# EAGLE design WS2812 hart (EAGLE 7.3.0)
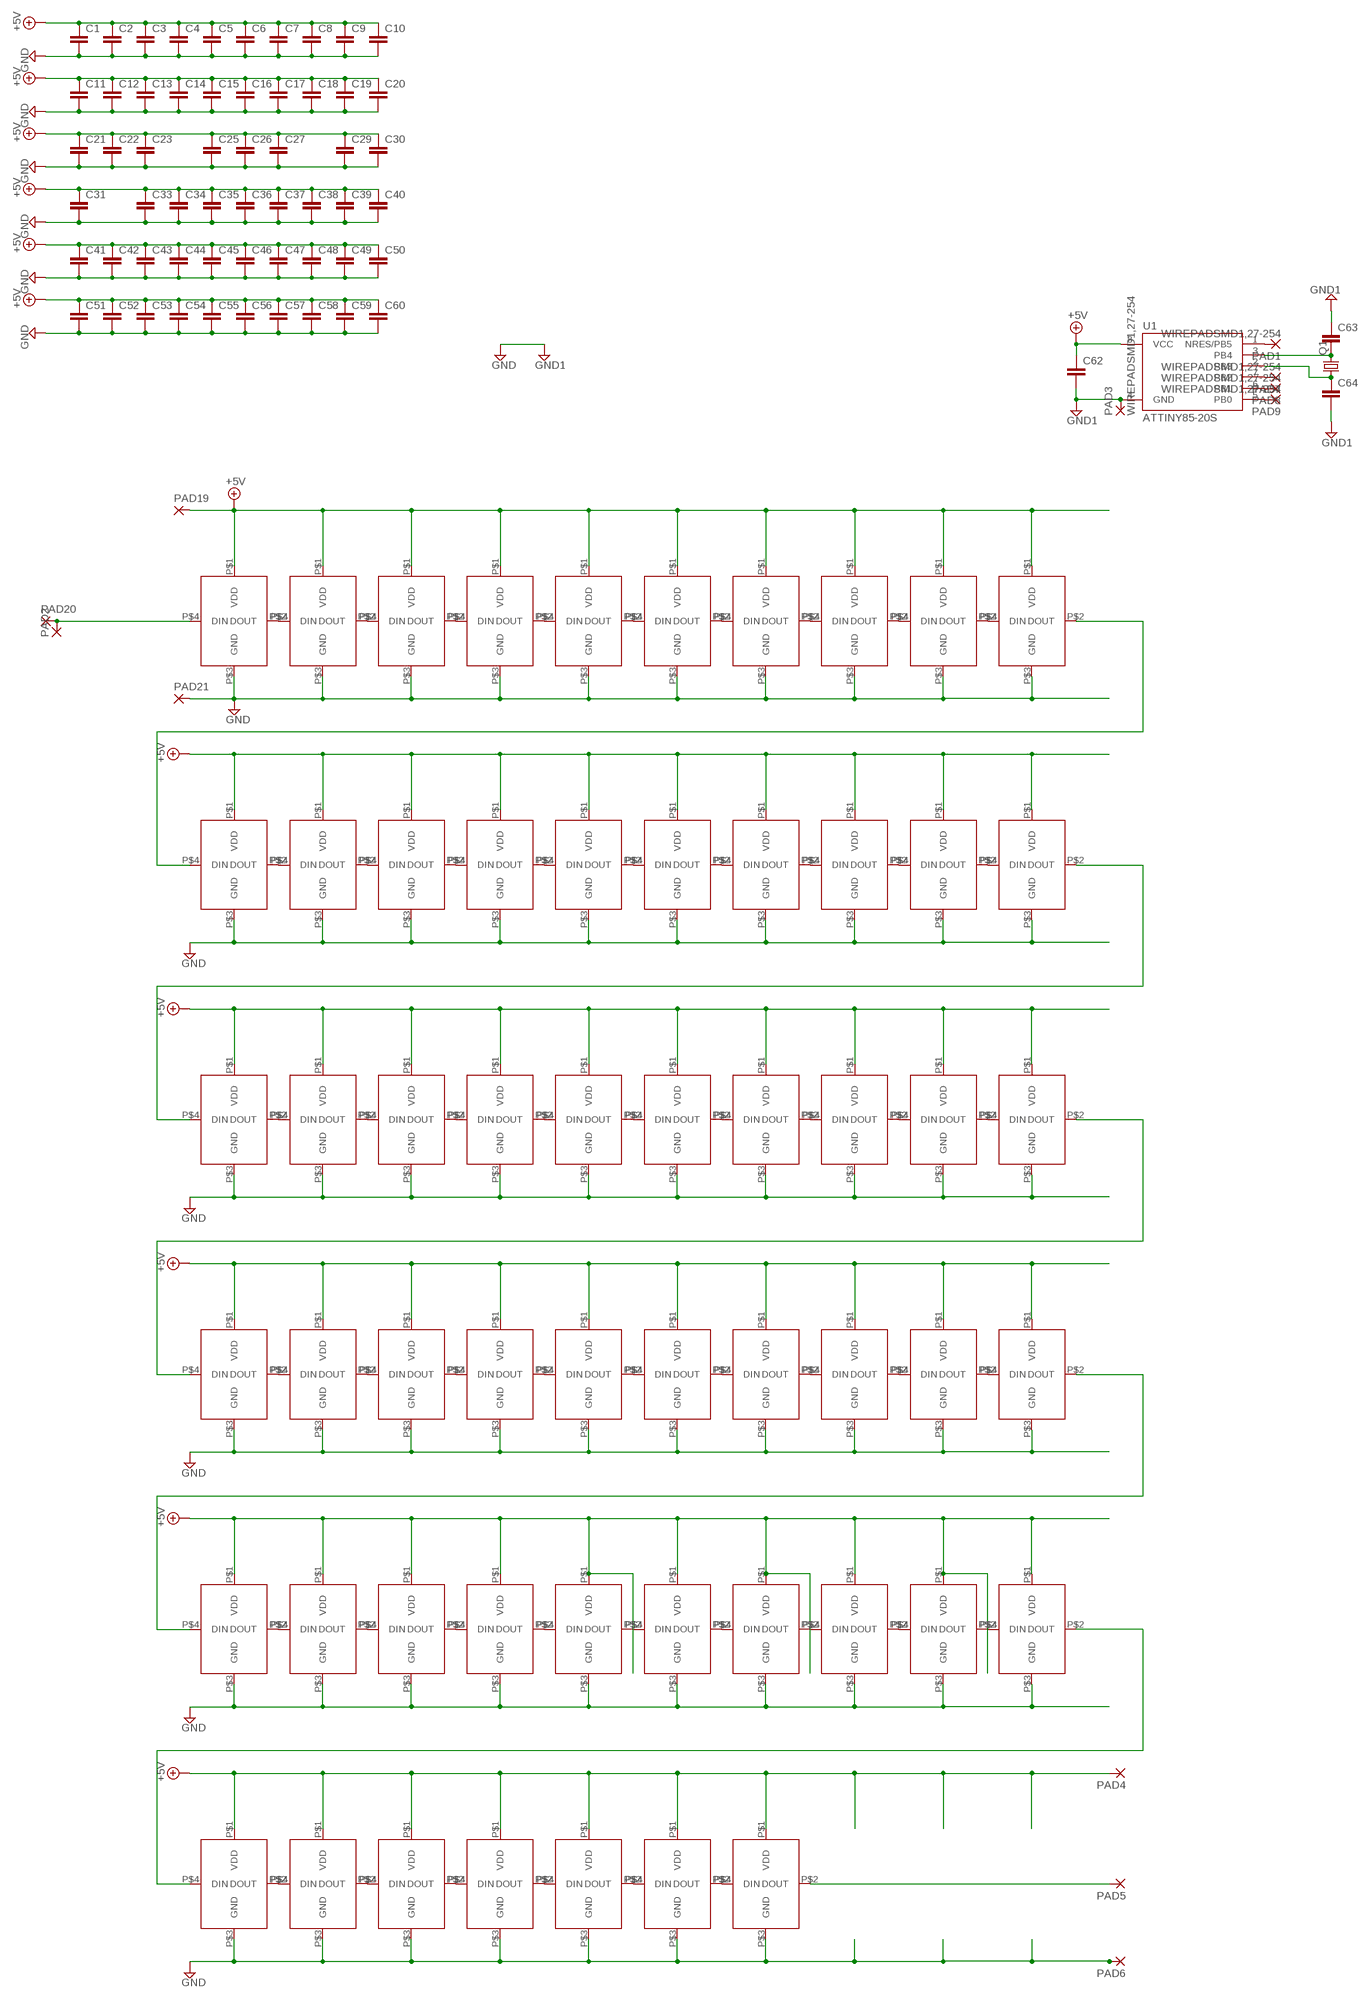
[diagram p0: schematic, sheet 1]

## Parts
C1  C-EUC1206K  [C1206K]
C2  C-EUC1206K  [C1206K]
C3  C-EUC1206K  [C1206K]
C4  C-EUC1206K  [C1206K]
C5  C-EUC1206K  [C1206K]
C6  C-EUC1206K  [C1206K]
C7  C-EUC1206K  [C1206K]
C8  C-EUC1206K  [C1206K]
C9  C-EUC1206K  [C1206K]
C10  C-EUC1206K  [C1206K]
C11  C-EUC1206K  [C1206K]
C12  C-EUC1206K  [C1206K]
C13  C-EUC1206K  [C1206K]
C14  C-EUC1206K  [C1206K]
C15  C-EUC1206K  [C1206K]
C16  C-EUC1206K  [C1206K]
C17  C-EUC0805K  [C0805K]
C18  C-EUC1206K  [C1206K]
C19  C-EUC1206K  [C1206K]
C20  C-EUC1206K  [C1206K]
C21  C-EUC1206K  [C1206K]
C22  C-EUC1206K  [C1206K]
C23  C-EUC1206K  [C1206K]
C25  C-EUC1206K  [C1206K]
C26  C-EUC1206K  [C1206K]
C27  C-EUC1206K  [C1206K]
C29  C-EUC1206K  [C1206K]
C30  C-EUC1206K  [C1206K]
C31  C-EUC1206K  [C1206K]
C33  C-EUC1206K  [C1206K]
C34  C-EUC1206K  [C1206K]
C35  C-EUC1206K  [C1206K]
C36  C-EUC1206K  [C1206K]
C37  C-EUC1206K  [C1206K]
C38  C-EUC1206K  [C1206K]
C39  C-EUC1206K  [C1206K]
C40  C-EUC1206K  [C1206K]
C41  C-EUC1206K  [C1206K]
C42  C-EUC1206K  [C1206K]
C43  C-EUC1206K  [C1206K]
C44  C-EUC1206K  [C1206K]
C45  C-EUC1206K  [C1206K]
C46  C-EUC1206K  [C1206K]
C47  C-EUC1206K  [C1206K]
C48  C-EUC1206K  [C1206K]
C49  C-EUC1206K  [C1206K]
C50  C-EUC1206K  [C1206K]
C51  C-EUC1206K  [C1206K]
C52  C-EUC0805K  [C0805K]
C53  C-EUC1206K  [C1206K]
C54  C-EUC1206K  [C1206K]
C55  C-EUC1206K  [C1206K]
C56  C-EUC1206K  [C1206K]
C57  C-EUC1206K  [C1206K]
C58  C-EUC1206K  [C1206K]
C59  C-EUC1206K  [C1206K]
C60  C-EUC1206K  [C1206K]
C62  C-EUC0805K  [C0805K]
C63  C-EUC0603K  [C0603K]
C64  C-EUC0603K  [C0603K]
PAD1  WIREPADSMD1,27-254  [SMD1,27-2,54]
PAD2  SMD5  [SMD2,54-5,08]
PAD3  WIREPADSMD1,27-254  [SMD1,27-2,54]
PAD4  1,6/0,8  [1,6/0,8]
PAD5  1,6/0,8  [1,6/0,8]
PAD6  1,6/0,8  [1,6/0,8]
PAD7  WIREPADSMD1,27-254  [SMD1,27-2,54]
PAD8  WIREPADSMD1,27-254  [SMD1,27-2,54]
PAD9  WIREPADSMD1,27-254  [SMD1,27-2,54]
PAD19  1,6/0,8  [1,6/0,8]
PAD20  1,6/0,8  [1,6/0,8]
PAD21  1,6/0,8  [1,6/0,8]
Q1  CRYSTALHC49S  [HC49/S]
U1  ATTINY85-20S  [SOIC8_EIAJ_208MIL]
U$1  WS2812B  [PLCC-4]
U$2  WS2812B  [PLCC-4]
U$3  WS2812B  [PLCC-4]
U$4  WS2812B  [PLCC-4]
U$5  WS2812B  [PLCC-4]
U$6  WS2812B  [PLCC-4]
U$7  WS2812B  [PLCC-4]
U$8  WS2812B  [PLCC-4]
U$9  WS2812B  [PLCC-4]
U$10  WS2812B  [PLCC-4]
U$11  WS2812B  [PLCC-4]
U$12  WS2812B  [PLCC-4]
U$13  WS2812B  [PLCC-4]
U$14  WS2812B  [PLCC-4]
U$15  WS2812B  [PLCC-4]
U$16  WS2812B  [PLCC-4]
U$17  WS2812B  [PLCC-4]
U$18  WS2812B  [PLCC-4]
U$19  WS2812B  [PLCC-4]
U$20  WS2812B  [PLCC-4]
U$21  WS2812B  [PLCC-4]
U$22  WS2812B  [PLCC-4]
U$23  WS2812B  [PLCC-4]
U$24  WS2812B  [PLCC-4]
U$25  WS2812B  [PLCC-4]
U$26  WS2812B  [PLCC-4]
U$27  WS2812B  [PLCC-4]
U$28  WS2812B  [PLCC-4]
U$29  WS2812B  [PLCC-4]
U$30  WS2812B  [PLCC-4]
U$31  WS2812B  [PLCC-4]
U$32  WS2812B  [PLCC-4]
U$33  WS2812B  [PLCC-4]
U$34  WS2812B  [PLCC-4]
U$35  WS2812B  [PLCC-4]
U$36  WS2812B  [PLCC-4]
U$37  WS2812B  [PLCC-4]
U$38  WS2812B  [PLCC-4]
U$39  WS2812B  [PLCC-4]
U$40  WS2812B  [PLCC-4]
U$41  WS2812B  [PLCC-4]
U$42  WS2812B  [PLCC-4]
U$43  WS2812B  [PLCC-4]
U$44  WS2812B  [PLCC-4]
U$45  WS2812B  [PLCC-4]
U$46  WS2812B  [PLCC-4]
U$47  WS2812B  [PLCC-4]
U$48  WS2812B  [PLCC-4]
U$49  WS2812B  [PLCC-4]
U$50  WS2812B  [PLCC-4]
U$51  WS2812B  [PLCC-4]
U$52  WS2812B  [PLCC-4]
U$53  WS2812B  [PLCC-4]
U$54  WS2812B  [PLCC-4]
U$55  WS2812B  [PLCC-4]
U$56  WS2812B  [PLCC-4]
U$57  WS2812B  [PLCC-4]

## Nets
+5V: C1.1 C2.1 C3.1 C4.1 C5.1 C6.1 C7.1 C8.1 C9.1 C10.1 C11.1 C12.1 C13.1 C14.1 C15.1 C16.1 C17.1 C18.1 C19.1 C20.1 C21.1 C22.1 C23.1 C25.1 C26.1 C27.1 C29.1 C30.1 C31.1 C33.1 C34.1 C35.1 C36.1 C37.1 C38.1 C39.1 C40.1 C41.1 C42.1 C43.1 C44.1 C45.1 C46.1 C47.1 C48.1 C49.1 C50.1 C51.1 C52.1 C53.1 C54.1 C55.1 C56.1 C57.1 C58.1 C59.1 C60.1 C62.1 PAD4.1(P) PAD19.1(P) U1.8(VCC) U$1.P$1(VDD) U$2.P$1(VDD) U$3.P$1(VDD) U$4.P$1(VDD) U$5.P$1(VDD) U$6.P$1(VDD) U$7.P$1(VDD) U$8.P$1(VDD) U$9.P$1(VDD) U$10.P$1(VDD) U$11.P$1(VDD) U$12.P$1(VDD) U$13.P$1(VDD) U$14.P$1(VDD) U$15.P$1(VDD) U$16.P$1(VDD) U$17.P$1(VDD) U$18.P$1(VDD) U$19.P$1(VDD) U$20.P$1(VDD) U$21.P$1(VDD) U$22.P$1(VDD) U$23.P$1(VDD) U$24.P$1(VDD) U$25.P$1(VDD) U$26.P$1(VDD) U$27.P$1(VDD) U$28.P$1(VDD) U$29.P$1(VDD) U$30.P$1(VDD) U$31.P$1(VDD) U$32.P$1(VDD) U$33.P$1(VDD) U$34.P$1(VDD) U$35.P$1(VDD) U$36.P$1(VDD) U$37.P$1(VDD) U$38.P$1(VDD) U$39.P$1(VDD) U$40.P$1(VDD) U$41.P$1(VDD) U$42.P$1(VDD) U$43.P$1(VDD) U$44.P$1(VDD) U$45.P$1(VDD) U$46.P$1(VDD) U$47.P$1(VDD) U$48.P$1(VDD) U$49.P$1(VDD) U$50.P$1(VDD) U$51.P$1(VDD) U$52.P$1(VDD) U$53.P$1(VDD) U$54.P$1(VDD) U$55.P$1(VDD) U$56.P$1(VDD) U$57.P$1(VDD)
GND: C1.2 C2.2 C3.2 C4.2 C5.2 C6.2 C7.2 C8.2 C9.2 C10.2 C11.2 C12.2 C13.2 C14.2 C15.2 C16.2 C17.2 C18.2 C19.2 C20.2 C21.2 C22.2 C23.2 C25.2 C26.2 C27.2 C29.2 C30.2 C31.2 C33.2 C34.2 C35.2 C36.2 C37.2 C38.2 C39.2 C40.2 C41.2 C42.2 C43.2 C44.2 C45.2 C46.2 C47.2 C48.2 C49.2 C50.2 C51.2 C52.2 C53.2 C54.2 C55.2 C56.2 C57.2 C58.2 C59.2 C60.2 C62.2 C63.1 C64.2 PAD3.1(P) PAD6.1(P) PAD21.1(P) U1.4(GND) U$1.P$3(GND) U$2.P$3(GND) U$3.P$3(GND) U$4.P$3(GND) U$5.P$3(GND) U$6.P$3(GND) U$7.P$3(GND) U$8.P$3(GND) U$9.P$3(GND) U$10.P$3(GND) U$11.P$3(GND) U$12.P$3(GND) U$13.P$3(GND) U$14.P$3(GND) U$15.P$3(GND) U$16.P$3(GND) U$17.P$3(GND) U$18.P$3(GND) U$19.P$3(GND) U$20.P$3(GND) U$21.P$3(GND) U$22.P$3(GND) U$23.P$3(GND) U$24.P$3(GND) U$25.P$3(GND) U$26.P$3(GND) U$27.P$3(GND) U$28.P$3(GND) U$29.P$3(GND) U$30.P$3(GND) U$31.P$3(GND) U$32.P$3(GND) U$33.P$3(GND) U$34.P$3(GND) U$35.P$3(GND) U$36.P$3(GND) U$37.P$3(GND) U$38.P$3(GND) U$39.P$3(GND) U$40.P$3(GND) U$41.P$3(GND) U$42.P$3(GND) U$43.P$3(GND) U$44.P$3(GND) U$45.P$3(GND) U$46.P$3(GND) U$47.P$3(GND) U$48.P$3(GND) U$49.P$3(GND) U$50.P$3(GND) U$51.P$3(GND) U$52.P$3(GND) U$53.P$3(GND) U$54.P$3(GND) U$55.P$3(GND) U$56.P$3(GND) U$57.P$3(GND) ; supply symbol labelled GND1
N$1: U$41.P$2(DOUT) U$42.P$4(DIN)
N$2: U$2.P$2(DOUT) U$3.P$4(DIN)
N$3: U$3.P$2(DOUT) U$4.P$4(DIN)
N$4: U$4.P$2(DOUT) U$5.P$4(DIN)
N$5: U$5.P$2(DOUT) U$6.P$4(DIN)
N$6: U$6.P$2(DOUT) U$7.P$4(DIN)
N$7: U$7.P$2(DOUT) U$8.P$4(DIN)
N$8: U$8.P$2(DOUT) U$9.P$4(DIN)
N$9: U$9.P$2(DOUT) U$10.P$4(DIN)
N$10: U$11.P$2(DOUT) U$12.P$4(DIN)
N$11: U$1.P$4(DIN) U$10.P$2(DOUT)
N$12: U$1.P$2(DOUT) U$41.P$4(DIN)
N$13: U$12.P$2(DOUT) U$13.P$4(DIN)
N$14: U$13.P$2(DOUT) U$14.P$4(DIN)
N$15: U$14.P$2(DOUT) U$15.P$4(DIN)
N$16: U$15.P$2(DOUT) U$16.P$4(DIN)
N$17: U$16.P$2(DOUT) U$17.P$4(DIN)
N$18: U$17.P$2(DOUT) U$18.P$4(DIN)
N$19: U$18.P$2(DOUT) U$19.P$4(DIN)
N$20: U$42.P$2(DOUT) U$43.P$4(DIN)
N$21: U$19.P$2(DOUT) U$20.P$4(DIN)
N$22: U$2.P$4(DIN) U$20.P$2(DOUT)
N$23: U$21.P$2(DOUT) U$22.P$4(DIN)
N$24: U$22.P$2(DOUT) U$23.P$4(DIN)
N$25: U$23.P$2(DOUT) U$24.P$4(DIN)
N$26: U$24.P$2(DOUT) U$25.P$4(DIN)
N$27: U$25.P$2(DOUT) U$26.P$4(DIN)
N$28: U$26.P$2(DOUT) U$27.P$4(DIN)
N$29: U$27.P$2(DOUT) U$28.P$4(DIN)
N$30: U$28.P$2(DOUT) U$29.P$4(DIN)
N$31: U$21.P$4(DIN) U$40.P$2(DOUT)
N$32: U$29.P$2(DOUT) U$30.P$4(DIN)
N$33: U$11.P$4(DIN) U$30.P$2(DOUT)
N$34: U$31.P$2(DOUT) U$32.P$4(DIN)
N$35: U$32.P$2(DOUT) U$33.P$4(DIN)
N$36: U$33.P$2(DOUT) U$34.P$4(DIN)
N$37: U$34.P$2(DOUT) U$35.P$4(DIN)
N$38: U$35.P$2(DOUT) U$36.P$4(DIN)
N$39: U$36.P$2(DOUT) U$37.P$4(DIN)
N$40: U$37.P$2(DOUT) U$38.P$4(DIN)
N$41: U$38.P$2(DOUT) U$39.P$4(DIN)
N$42: PAD2.1(P) PAD20.1(P) U$31.P$4(DIN)
N$43: U$39.P$2(DOUT) U$40.P$4(DIN)
N$44: U$43.P$2(DOUT) U$44.P$4(DIN)
N$45: U$44.P$2(DOUT) U$45.P$4(DIN)
N$46: U$45.P$2(DOUT) U$46.P$4(DIN)
N$47: U$46.P$2(DOUT) U$47.P$4(DIN)
N$48: U$47.P$2(DOUT) U$48.P$4(DIN)
N$49: U$48.P$2(DOUT) U$49.P$4(DIN)
N$50: U$49.P$2(DOUT) U$50.P$4(DIN)
N$51: U$50.P$2(DOUT) U$51.P$4(DIN)
N$52: C63.2 Q1.2 U1.3(PB4)
N$53: U$51.P$2(DOUT) U$52.P$4(DIN)
N$54: U$52.P$2(DOUT) U$53.P$4(DIN)
N$55: U$53.P$2(DOUT) U$54.P$4(DIN)
N$56: U$54.P$2(DOUT) U$55.P$4(DIN)
N$57: U$55.P$2(DOUT) U$56.P$4(DIN)
N$58: U$56.P$2(DOUT) U$57.P$4(DIN)
N$59: C64.1 Q1.1 U1.2(PB3)
N$60: PAD1.1(P) U1.1(NRES/PB5)
N$62: PAD5.1(P) U$57.P$2(DOUT)
N$64: PAD7.1(P) U1.7(PB2)
N$65: PAD8.1(P) U1.6(PB1)
N$66: PAD9.1(P) U1.5(PB0)

## Library data of the parts
C1-C23 C25-C27 C29-C31 C33-C60 C62-C64 = rcl:C-EU: CAPACITOR, European symbol
PAD1 PAD3 PAD7-PAD9 = wirepad:WIREPAD: Wire PAD connect wire on PCB
PAD2 = wirepad:SMD5: SMD PAD
PAD4-PAD6 PAD19-PAD21 = wirepad:1,6/0,8: THROUGH-HOLE PAD
Q1 = crystal:CRYSTAL: CRYSTAL; OC_FARNELL: 1667008; OC_NEWARK: unknown
U1 = attiny25_45_85:ATTINY85*: ATMEL ATtiny 85 Packages: P = PDIP 08 30mil S = SOIC 08 EIAJ 208mil Technologies Note: for complete ordering code (temp. range, finish, tape&reel etc.) see www.atmel.com • Supply Voltage: V = (1.8…5.5)V | [blank] = (2.7…5.5)V • Speed: 10 = 10 MHz | 20 = 20 MHz Author: Dipl.-Ing. FH Rainer Bayer HHN Hochschule Heilbronn (Heilbronn University), rainer.bayer@hs-heilbronn.de Ingenieurbüro ing-rb, mail@ing-rb.de
U$1-U$57 = Roy:WS2812B

## Board
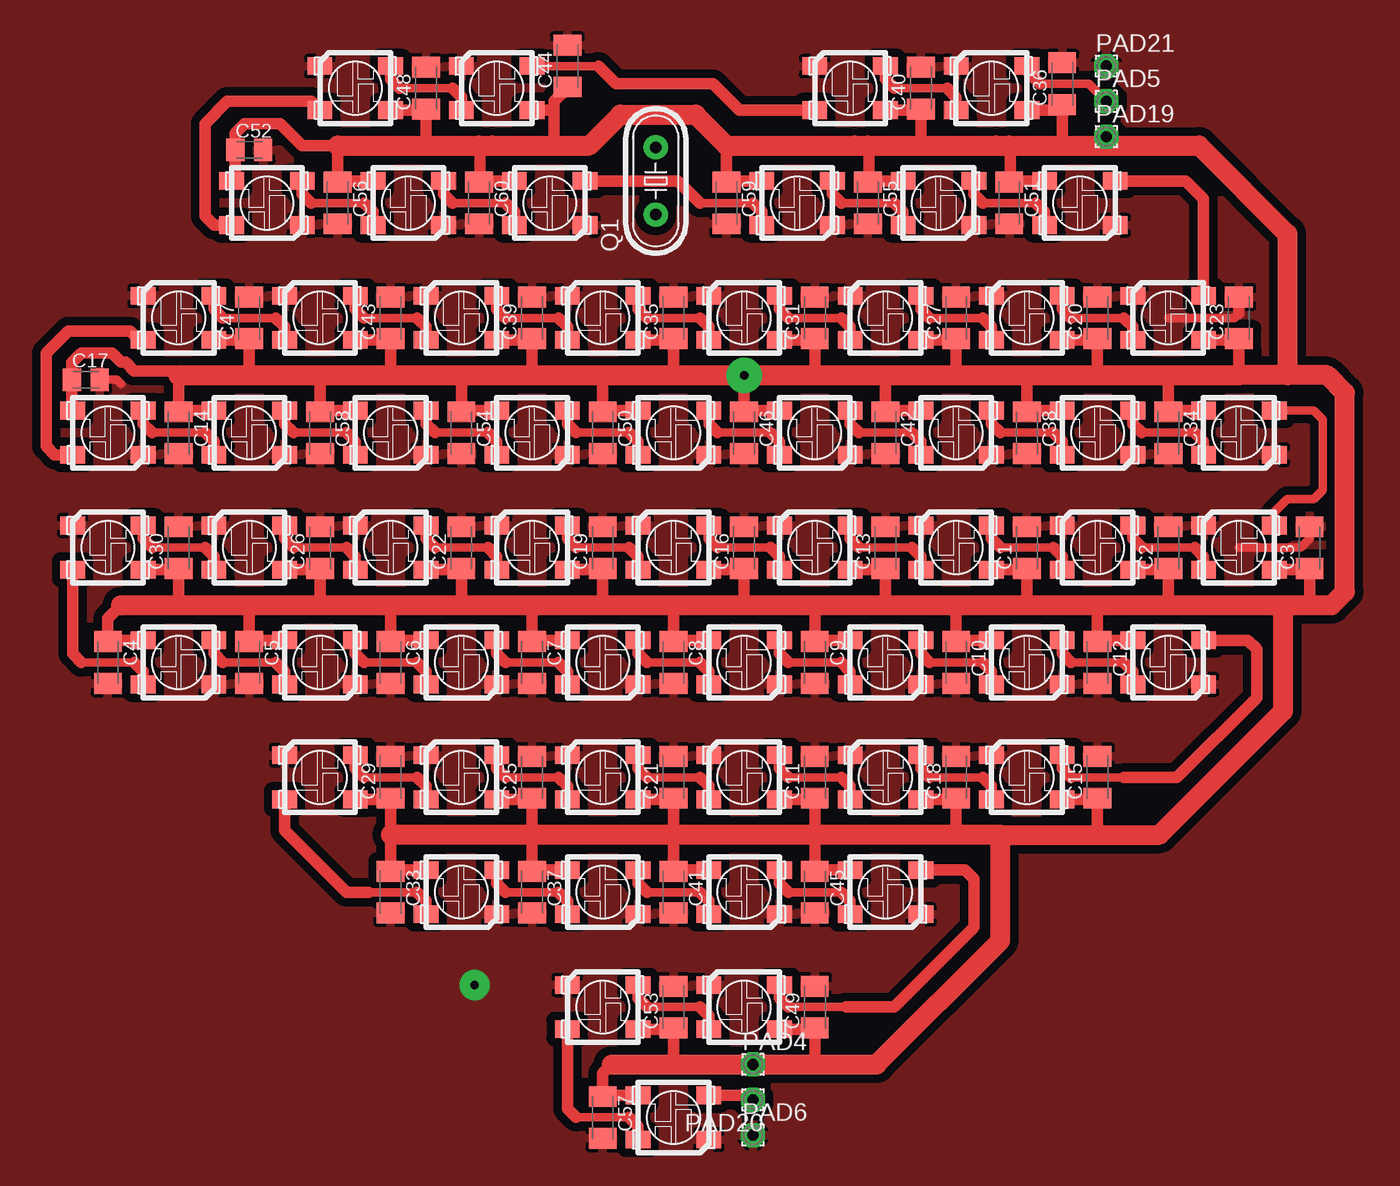
[diagram p1: board, top side]
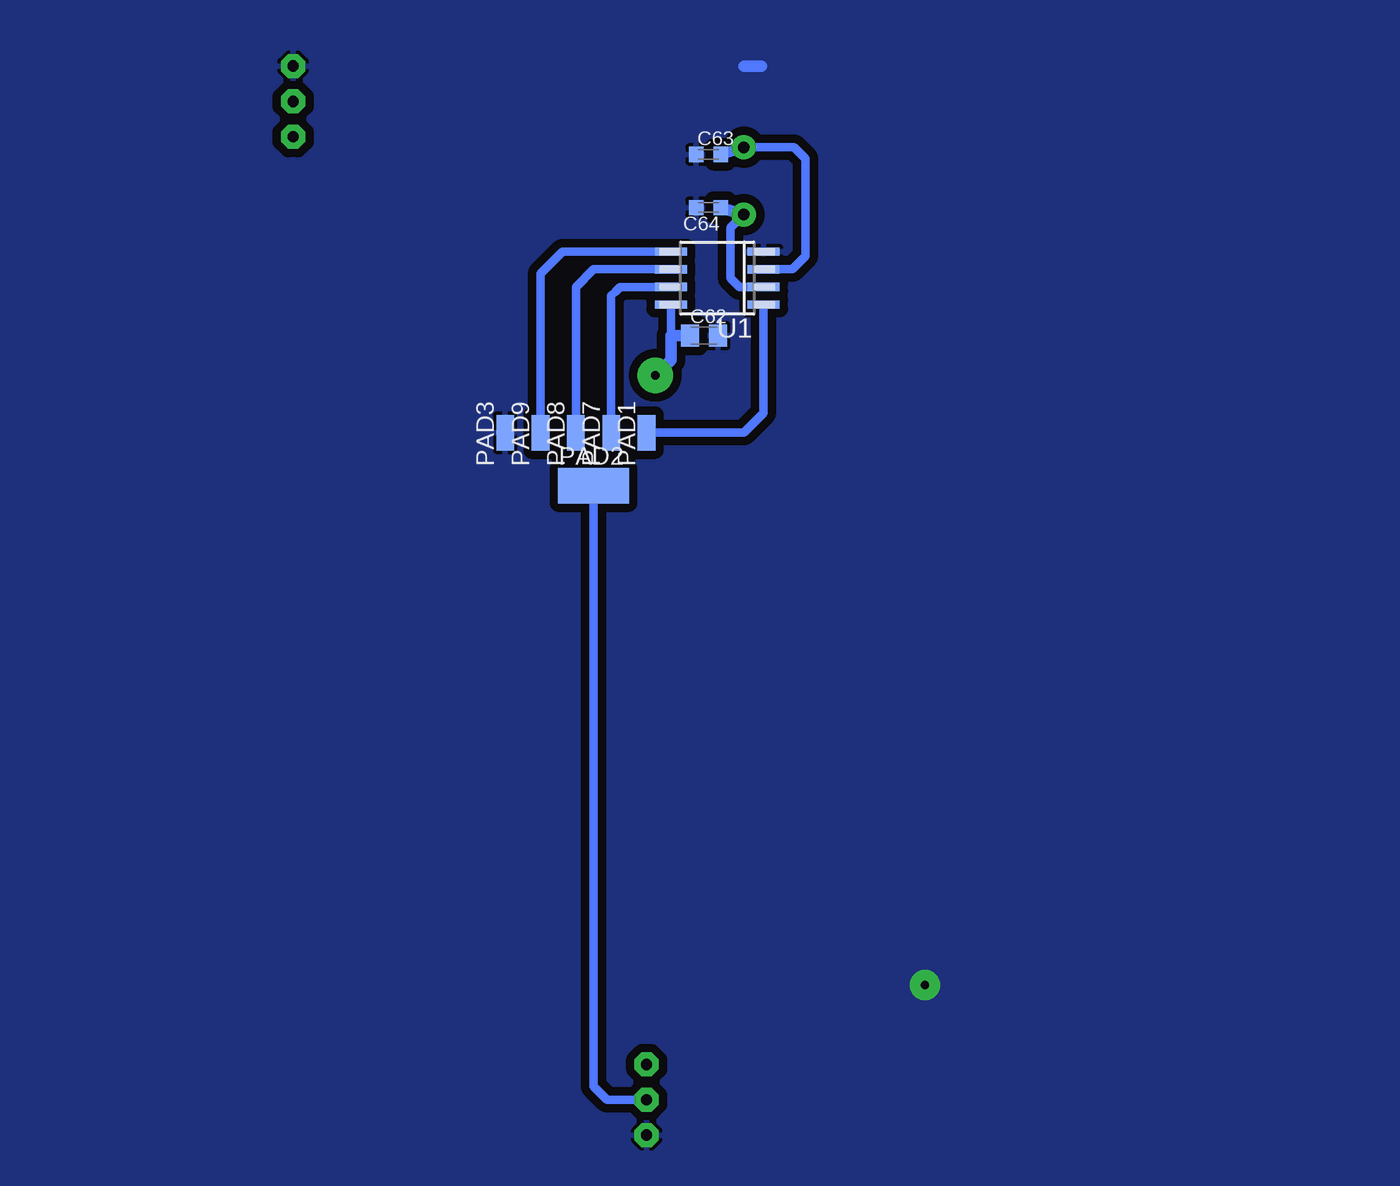
[diagram p2: board, bottom side, seen from below]

No outline drawn. Coordinates in mm, seen from the top.
Copper layers (1*16): Top 0.035mm / dielectric 1.5mm / Bottom 0.035mm
Design rules "default *": minimum track width 10mil, minimum drill 19mil, track to track 8mil, track to pad 8mil, pad to pad 8mil, via to via 8mil, smd to smd 8mil, copper to edge 40mil, drill to drill 8mil, minimum pad ring 18mil, minimum via ring 8mil, stop-mask expansion 4mil, vias tented up to drill 0mil, thermal gap 10mil
tRestrict: 1 lines

### Footprints (pad centres in the part's own frame; a part is rotated, then mirrored left to right if it is on the bottom)
C1206K = smd 1.5 x 2: 1 -1.5,0; 2 1.5,0
C0805K = smd 1.3 x 1.6: 1 -1,0; 2 1,0
C0603K = smd 1.05 x 1.08: 1 -0.875,0; 2 0.875,0
SMD1,27-2,54 = smd 1.27 x 2.54: 1 0,0
SMD2,54-5,08 = smd 2.54 x 5.08: 1 0,0
1,6/0,8 = drill 0.813 pad 1.6 octagon: 1 0,0
HC49/S = drill 0.813: 1 -2.413,0; 2 2.413,0
SOIC8_EIAJ_208MIL = smd 0.6 x 2.286: 1 -1.905,-3.33; 2 -0.635,-3.33; 3 0.635,-3.33; 4 1.905,-3.33; 5 1.905,3.33; 6 0.635,3.33; 7 -0.635,3.33; 8 -1.905,3.33
PLCC-4 = smd 1.778 x 1.27: P$1 -2.54,1.587; P$2 -2.54,-1.587; P$3 2.54,-1.587; P$4 2.54,1.587

### Placement (x,y rotation side)
C1  74.3,42.55 90 top
C2  84.45,42.55 90 top
C3  94.61,42.55 90 top
C4  8.26,34.29 270 top
C5  18.41,34.29 270 top
C6  28.57,34.29 270 top
C7  38.73,34.29 270 top
C8  48.9,34.29 270 top
C9  59.05,34.29 270 top
C10  69.22,34.29 270 top
C11  59.05,26.04 90 top
C12  79.38,34.29 270 top
C13  64.14,42.55 90 top
C14  13.34,50.8 270 top
C15  79.38,26.04 90 top
C16  53.98,42.55 90 top
C17  6.67,54.61 0 top
C18  69.22,26.04 90 top
C19  43.81,42.55 90 top
C20  79.38,59.05 90 top
C21  48.9,26.04 90 top
C22  33.66,42.55 90 top
C23  89.53,59.05 90 top
C25  38.73,26.04 90 top
C26  23.5,42.55 90 top
C27  69.22,59.05 90 top
C29  28.57,26.04 90 top
C30  13.34,42.55 90 top
C31  59.05,59.05 90 top
C33  28.57,17.78 270 top
C34  84.45,50.8 270 top
C35  48.9,59.05 90 top
C36  76.83,75.88 90 top
C37  38.73,17.78 270 top
C38  74.3,50.8 270 top
C39  38.73,59.05 90 top
C40  66.67,75.56 90 top
C41  48.9,17.78 270 top
C42  64.14,50.8 270 top
C43  28.57,59.05 90 top
C44  41.27,77.15 90 top
C45  59.05,17.78 270 top
C46  53.98,50.8 270 top
C47  18.41,59.05 90 top
C48  31.11,75.56 90 top
C49  59.05,9.53 90 top
C50  43.81,50.8 270 top
C51  73.03,67.31 270 top
C52  18.41,71.12 0 top
C53  48.9,9.53 90 top
C54  33.66,50.8 270 top
C55  62.87,67.31 270 top
C56  24.77,67.31 270 top
C57  43.81,1.59 270 top
C58  23.5,50.8 270 top
C59  52.7,67.31 270 top
C60  34.92,67.31 270 top
C62  50.48,57.78 0 bottom
C63  50.16,70.8 0 bottom
C64  50.16,66.99 180 bottom
PAD1  54.61,50.8 0 bottom
PAD2  58.42,46.99 270 bottom
PAD3  64.77,50.8 0 bottom
PAD4  54.61,5.4 0 top
PAD5  80.01,74.61 0 top
PAD6  54.61,0.32 0 top
PAD7  57.15,50.8 0 bottom
PAD8  59.69,50.8 0 bottom
PAD9  62.23,50.8 0 bottom
PAD19  80.01,72.07 0 top
PAD20  54.61,2.86 180 top
PAD21  80.01,77.15 0 top
Q1  47.62,68.9 90 top
U1  49.53,61.91 90 bottom
U$1  13.34,59.05 180 top
U$2  89.53,50.8 0 top
U$3  79.38,50.8 0 top
U$4  69.22,50.8 0 top
U$5  59.05,50.8 0 top
U$6  48.9,50.8 0 top
U$7  38.73,50.8 0 top
U$8  28.57,50.8 0 top
U$9  18.41,50.8 0 top
U$10  8.26,50.8 0 top
U$11  13.34,34.29 0 top
U$12  8.26,42.55 180 top
U$13  18.41,42.55 180 top
U$14  28.57,42.55 180 top
U$15  38.73,42.55 180 top
U$16  48.9,42.55 180 top
U$17  59.05,42.55 180 top
U$18  69.22,42.55 180 top
U$19  79.38,42.55 180 top
U$20  89.53,42.55 180 top
U$21  53.98,26.04 180 top
U$22  64.14,26.04 180 top
U$23  74.3,26.04 180 top
U$24  84.45,34.29 0 top
U$25  74.3,34.29 0 top
U$26  64.14,34.29 0 top
U$27  53.98,34.29 0 top
U$28  43.81,34.29 0 top
U$29  33.66,34.29 0 top
U$30  23.5,34.29 0 top
U$31  48.9,1.59 0 top
U$32  43.81,9.53 180 top
U$33  53.98,9.53 180 top
U$34  64.14,17.78 0 top
U$35  53.98,17.78 0 top
U$36  43.81,17.78 0 top
U$37  33.66,17.78 0 top
U$38  23.5,26.04 180 top
U$39  33.66,26.04 180 top
U$40  43.81,26.04 180 top
U$41  23.5,59.05 180 top
U$42  33.66,59.05 180 top
U$43  43.81,59.05 180 top
U$44  53.98,59.05 180 top
U$45  64.14,59.05 180 top
U$46  74.3,59.05 180 top
U$47  84.45,59.05 180 top
U$48  78.11,67.31 0 top
U$49  67.94,67.31 0 top
U$50  57.78,67.31 0 top
U$51  40.01,67.31 0 top
U$52  29.84,67.31 0 top
U$53  19.68,67.31 0 top
U$54  26.04,75.56 180 top
U$55  36.2,75.56 180 top
U$56  61.59,75.56 180 top
U$57  71.75,75.56 180 top

### Tracks (layer width: path | path; a pad name or v marks a point on that pad's centre or on a via)
+5V  (via drill 0.6 pad 2.54)
  Top 0.813: 61.59,19.05 U$34.P$1 59.14,19.37 C45.1 59.05,21.91 C11.1 58.97,24.45 U$21.P$1 | 76.83,57.78 U$46.P$1 79.29,57.47 C20.1 79.38,54.93 | 37.78,68.9 U$51.P$1 35.01,68.9 | PAD19.1 80.01,71.44 | 36.11,71.67 35.88,71.44 | 25.95,71.53 24.77,71.44 | 61.51,71.53 61.91,71.44 | 71.67,71.53 72.07,71.44 | 66.67,71.44 C40.1 66.59,73.98 U$56.P$1 | 76.83,71.44 C36.1 76.43,73.98 U$57.P$1 | C44.1 41.27,75.56 40.32,74.61 40.32,73.98 | 40.32,73.98 40.32,71.44 | U$55.P$1 40.32,73.98 | 31.11,71.44 C48.1 31.03,73.98 U$54.P$1 | U$52.P$1 24.85,68.9 | 24.85,68.9 C56.1 | 35.01,68.9 C60.1 | U$49.P$1 62.95,68.9 | 62.95,68.9 C55.1 | U$48.P$1 73.11,68.9 | 73.11,68.9 C51.1 | 35.01,68.9 35.01,71.35 34.92,71.44 | 62.95,68.9 62.95,71.35 62.87,71.44 | 73.11,68.9 73.11,71.35 73.03,71.44 | 89.53,54.93 C23.1 89.45,57.47 U$47.P$1 | 69.22,54.93 C27.1 69.13,57.47 U$45.P$1 | 58.74,54.93 59.05,55.24 C31.1 58.97,57.47 U$44.P$1 | U$50.P$1 52.79,68.9 C59.1 52.7,71.44 | 23.5,54.93 C58.1 23.58,52.39 U$8.P$1 | 33.66,54.93 C54.1 33.74,52.39 U$7.P$1 | 43.81,54.93 C50.1 43.9,52.39 U$6.P$1 | v53.98,54.93 C46.1 54.06,52.39 U$5.P$1 | 64.14,54.93 C42.1 64.22,52.39 U$4.P$1 | 74.61,54.93 74.3,54.61 C38.1 74.38,52.39 U$3.P$1 | 84.45,54.93 C34.1 84.54,52.39 U$2.P$1 | U$9.P$1 13.42,52.39 C14.1 13.34,54.93 13.02,55.24 10.16,55.24 9.53,55.88 9.21,55.88 8.57,56.52 6.35,56.52 5.67,55.83 C17.1 5.67,52.75 U$10.P$1 | 18.41,54.93 C47.1 18.33,57.47 U$1.P$1 | 28.57,54.93 C43.1 28.49,57.47 U$41.P$1 | 38.73,54.93 C39.1 38.65,57.47 U$42.P$1 | 48.58,54.93 48.9,55.24 C35.1 48.81,57.47 U$43.P$1 | 13.34,38.42 C30.1 13.25,40.96 U$12.P$1 | 23.5,38.42 C26.1 23.41,40.96 U$13.P$1 | 33.66,38.42 C22.1 33.57,40.96 U$14.P$1
  Top 0.813: 43.81,38.42 C19.1 43.73,40.96 U$15.P$1 | 53.98,38.42 C16.1 53.89,40.96 U$16.P$1 | 64.14,38.42 C13.1 64.05,40.96 U$17.P$1 | 74.3,38.42 C1.1 74.21,40.96 U$18.P$1 | 84.45,38.42 C2.1 84.37,40.96 U$19.P$1 | 94.61,38.42 C3.1 94.53,40.96 U$20.P$1 | 9.21,38.42 8.26,37.47 C4.1 8.34,35.88 U$11.P$1 | 18.41,38.42 C5.1 18.5,35.88 U$30.P$1 | 28.57,38.42 C6.1 28.66,35.88 U$29.P$1 | 38.73,38.42 C7.1 38.82,35.88 U$28.P$1 | 48.9,38.42 C8.1 48.98,35.88 U$27.P$1 | 59.05,38.42 C9.1 59.14,35.88 U$26.P$1 | 69.22,38.42 C10.1 69.3,35.88 U$25.P$1 | 79.38,38.42 C12.1 79.46,35.88 U$24.P$1 | 69.22,21.91 C18.1 69.13,24.45 U$22.P$1 | 79.38,21.91 C15.1 79.29,24.45 U$23.P$1 | U$40.P$1 48.81,24.45 C21.1 48.9,21.91 C41.1 48.98,19.37 U$35.P$1 | U$39.P$1 38.65,24.45 C25.1 38.73,21.91 C37.1 38.82,19.37 U$36.P$1 | U$38.P$1 28.49,24.45 C29.1 28.57,21.91 C33.1 28.66,19.37 U$37.P$1 | 59.05,5.4 C49.1 58.97,7.94 U$33.P$1 | 48.9,5.4 C53.1 48.81,7.94 U$32.P$1 | 44.45,5.4 43.81,4.76 C57.1 43.9,3.17 U$31.P$1 | U$53.P$1 17.41,69.17 C52.1 17.41,72.34 18.1,73.03 20.64,73.03 22.23,71.44 24.77,71.44 | 24.85,68.9 24.77,68.98 24.77,71.44
  Top 1.422: 72.39,21.91 69.22,21.91 59.05,21.91 48.9,21.91 38.73,21.91 28.57,21.91 | 44.45,5.4 48.9,5.4 PAD4.1 59.05,5.4 63.5,5.4 72.39,14.29 72.39,21.91 | 9.21,38.42 13.34,38.42 18.41,38.42 23.5,38.42 28.57,38.42 33.66,38.42 38.73,38.42 43.81,38.42 48.9,38.42 53.98,38.42 59.05,38.42 64.14,38.42 69.22,38.42 74.3,38.42 79.38,38.42 84.45,38.42 92.71,38.42 | 13.34,54.93 18.41,54.93 23.5,54.93 28.57,54.93 33.66,54.93 38.73,54.93 43.81,54.93 48.58,54.93 v53.98,54.93 58.74,54.93 64.14,54.93 69.22,54.93 74.61,54.93 79.38,54.93 84.45,54.93 89.53,54.93 93.03,54.93 | 24.77,71.44 31.11,71.44 34.92,71.44 35.88,71.44 40.32,71.44 42.86,71.44 45.09,73.66 50.48,73.66 52.7,71.44 61.91,71.44 62.87,71.44 66.67,71.44 72.07,71.44 73.03,71.44 76.83,71.44 80.01,71.44 86.68,71.44 93.03,65.09 93.03,54.93 | 72.39,21.91 79.38,21.91 83.82,21.91 92.71,30.8 92.71,38.42 | 92.71,38.42 94.61,38.42 96.2,38.42 97.16,39.37 97.16,53.66 95.89,54.93 93.03,54.93
  Bottom 0.61: U1.8 52.86,57.78
  Bottom 0.813: v53.98,54.93 52.86,56.03 52.86,57.78 C62.1
GND  (via drill 0.6 pad 2.18)
  Top 0.61: 7.62,54.61 8.89,54.61 9.21,54.29 | C3.2 94.61,43.18 93.98,42.55 89.53,42.55 | 89.53,59.37 89.22,59.05 84.45,59.05
  Top 0.813: C23.2 89.53,59.37
  Bottom 0.813: 46.35,77.15 47.62,77.15
  other vias: 34.61,11.11
  pour Top (isolate 0.61): -5.08,86.36 102.87,86.36 102.87,-6.35 -5.08,-6.35
  pour Bottom (isolate 0.61): -5.08,86.36 102.87,86.36 102.87,-6.35 -5.08,-6.35
N$1
  Top 0.61: 26.67,59.05 30.48,59.05
  Top 0.813: U$41.P$2 26.04,59.69 26.67,59.05 | 30.48,59.05 31.11,58.42 U$42.P$4
N$2
  Top 0.61: 82.55,50.8 86.36,50.8
  Top 0.813: U$3.P$4 81.92,51.44 82.55,50.8 | 86.36,50.8 87,50.16 U$2.P$2
N$3
  Top 0.61: 72.39,50.8 76.2,50.8
  Top 0.813: U$4.P$4 71.75,51.44 72.39,50.8 | 76.2,50.8 76.83,50.16 U$3.P$2
N$4
  Top 0.61: 62.23,50.8 66.04,50.8
  Top 0.813: U$5.P$4 61.59,51.44 62.23,50.8 | 66.04,50.8 66.67,50.16 U$4.P$2
N$5
  Top 0.61: 52.07,50.8 55.88,50.8
  Top 0.813: U$6.P$4 51.44,51.44 52.07,50.8 | 55.88,50.8 56.52,50.16 U$5.P$2
N$6
  Top 0.61: 41.91,50.8 45.72,50.8
  Top 0.813: U$7.P$4 41.27,51.44 41.91,50.8 | 45.72,50.8 46.35,50.16 U$6.P$2
N$7
  Top 0.61: 31.75,50.8 35.56,50.8
  Top 0.813: U$8.P$4 31.11,51.44 31.75,50.8 | 35.56,50.8 36.2,50.16 U$7.P$2
N$8
  Top 0.61: 21.59,50.8 25.4,50.8
  Top 0.813: U$9.P$4 20.95,51.44 21.59,50.8 | 25.4,50.8 26.04,50.16 U$8.P$2
N$9
  Top 0.61: 11.43,50.8 15.24,50.8
  Top 0.813: U$10.P$4 10.79,51.44 11.43,50.8 | 15.24,50.8 15.88,50.16 U$9.P$2
N$10
  Top 0.61: 10.16,34.29 6.35,34.29
  Top 0.813: U$11.P$2 10.79,33.66 10.16,34.29 | 6.35,34.29 5.71,34.92 U$12.P$4
N$11
  Top 0.813: U$1.P$4 10.48,57.47 9.84,58.1 5.4,58.1 3.81,56.52 3.81,49.85 4.45,49.21 U$10.P$2
N$12
  Top 0.61: 16.51,59.05 20.32,59.05
  Top 0.813: U$1.P$2 15.88,59.69 16.51,59.05 | 20.32,59.05 20.95,58.42 U$41.P$4
N$13
  Top 0.61: 11.43,42.55 15.24,42.55
  Top 0.813: U$12.P$2 10.79,43.18 11.43,42.55 | 15.24,42.55 15.88,41.91 U$13.P$4
N$14
  Top 0.61: 21.59,42.55 25.4,42.55
  Top 0.813: U$13.P$2 20.95,43.18 21.59,42.55 | 25.4,42.55 26.04,41.91 U$14.P$4
N$15
  Top 0.61: 31.75,42.55 35.56,42.55
  Top 0.813: U$14.P$2 31.11,43.18 31.75,42.55 | 35.56,42.55 36.2,41.91 U$15.P$4
N$16
  Top 0.61: 41.91,42.55 45.72,42.55
  Top 0.813: U$15.P$2 41.27,43.18 41.91,42.55 | 45.72,42.55 46.35,41.91 U$16.P$4
N$17
  Top 0.61: 52.07,42.55 55.88,42.55
  Top 0.813: U$16.P$2 51.44,43.18 52.07,42.55 | 55.88,42.55 56.52,41.91 U$17.P$4
N$18
  Top 0.61: 62.23,42.55 66.04,42.55
  Top 0.813: U$17.P$2 61.59,43.18 62.23,42.55 | 66.04,42.55 66.67,41.91 U$18.P$4
N$19
  Top 0.61: 72.39,42.55 76.2,42.55
  Top 0.813: U$18.P$2 71.75,43.18 72.39,42.55 | 76.2,42.55 76.83,41.91 U$19.P$4
N$20
  Top 0.61: 36.83,59.05 40.64,59.05
  Top 0.813: U$42.P$2 36.2,59.69 36.83,59.05 | 40.64,59.05 41.27,58.42 U$43.P$4
N$21
  Top 0.61: 82.55,42.55 86.36,42.55
  Top 0.813: U$19.P$2 81.92,43.18 82.55,42.55 | 86.36,42.55 87,41.91 U$20.P$4
N$22
  Top 0.61: U$20.P$2 92.08,45.09 93.03,46.04 94.93,46.04 95.57,46.67 95.57,51.75 94.93,52.39 U$2.P$4
N$23
  Top 0.61: 57.15,26.04 60.96,26.04
  Top 0.813: U$21.P$2 56.52,26.67 57.15,26.04 | 60.96,26.04 61.59,25.4 U$22.P$4
N$24
  Top 0.61: 67.31,26.04 71.12,26.04
  Top 0.813: U$22.P$2 66.67,26.67 67.31,26.04 | 71.12,26.04 71.75,25.4 U$23.P$4
N$25
  Top 0.61: 77.47,26.04 81.28,26.04
  Top 0.813: U$23.P$2 76.83,26.67 77.47,26.04 | 81.28,26.04 85.09,26.04 90.81,31.75 90.81,35.24 90.17,35.88 U$24.P$4
N$26
  Top 0.61: 77.47,34.29 81.28,34.29
  Top 0.813: U$25.P$4 76.83,34.92 77.47,34.29 | 81.28,34.29 81.92,33.66 U$24.P$2
N$27
  Top 0.61: 67.31,34.29 71.12,34.29
  Top 0.813: U$26.P$4 66.67,34.92 67.31,34.29 | 71.12,34.29 71.75,33.66 U$25.P$2
N$28
  Top 0.61: 57.15,34.29 60.96,34.29
  Top 0.813: U$27.P$4 56.52,34.92 57.15,34.29 | 60.96,34.29 61.59,33.66 U$26.P$2
N$29
  Top 0.61: 46.99,34.29 50.8,34.29
  Top 0.813: U$28.P$4 46.35,34.92 46.99,34.29 | 50.8,34.29 51.44,33.66 U$27.P$2
N$30
  Top 0.61: 36.83,34.29 40.64,34.29
  Top 0.813: U$29.P$4 36.2,34.92 36.83,34.29 | 40.64,34.29 41.27,33.66 U$28.P$2
N$31
  Top 0.61: 46.99,26.04 50.8,26.04
  Top 0.813: U$40.P$2 46.35,26.67 46.99,26.04 | 50.8,26.04 51.44,25.4 U$21.P$4
N$32
  Top 0.61: 26.67,34.29 30.48,34.29
  Top 0.813: U$30.P$4 26.04,34.92 26.67,34.29 | 30.48,34.29 31.11,33.66 U$29.P$2
N$33
  Top 0.61: 16.51,34.29 20.32,34.29
  Top 0.813: U$11.P$4 15.88,34.92 16.51,34.29 | 20.32,34.29 20.95,33.66 U$30.P$2
N$34
  Top 0.61: 45.72,1.59 41.91,1.59
  Top 0.813: U$31.P$2 46.35,0.95 45.72,1.59 | 41.91,1.59 41.27,2.22 U$32.P$4
N$35
  Top 0.61: 46.99,9.53 50.8,9.53
  Top 0.813: U$32.P$2 46.35,10.16 46.99,9.53 | 50.8,9.53 51.44,8.89 U$33.P$4
N$36
  Top 0.61: 57.15,9.53 61.28,9.53
  Top 0.813: U$33.P$2 56.52,10.16 57.15,9.53 | 61.28,9.53 64.77,9.53 70.48,15.24 70.48,18.73 69.85,19.37 U$34.P$4
N$37
  Top 0.61: 57.15,17.78 60.96,17.78
  Top 0.813: U$35.P$4 56.52,18.41 57.15,17.78 | 60.96,17.78 61.59,17.14 U$34.P$2
N$38
  Top 0.61: 46.99,17.78 50.8,17.78
  Top 0.813: U$36.P$4 46.35,18.41 46.99,17.78 | 50.8,17.78 51.44,17.14 U$35.P$2
N$39
  Top 0.61: 36.83,17.78 40.64,17.78
  Top 0.813: U$37.P$4 36.2,18.41 36.83,17.78 | 40.64,17.78 41.27,17.14 U$36.P$2
N$40
  Top 0.61: 30.48,17.78 26.99,17.78
  Top 0.813: U$37.P$2 31.11,17.14 30.48,17.78 | 26.99,17.78 25.4,17.78 20.95,22.23 U$38.P$4
N$41
  Top 0.61: 26.67,26.04 30.48,26.04
  Top 0.813: U$38.P$2 26.04,26.67 26.67,26.04 | 30.48,26.04 31.11,25.4 U$39.P$4
N$42
  Top 0.813: U$31.P$4 54.29,3.17 PAD20.1
  Bottom 0.61: PAD20.1 57.47,2.86 58.42,3.81 PAD2.1
N$43
  Top 0.61: 36.83,26.04 40.64,26.04
  Top 0.813: U$39.P$2 36.2,26.67 36.83,26.04 | 40.64,26.04 41.27,25.4 U$40.P$4
N$44
  Top 0.61: 46.99,59.05 50.8,59.05
  Top 0.813: U$43.P$2 46.35,59.69 46.99,59.05 | 50.8,59.05 51.44,58.42 U$44.P$4
N$45
  Top 0.61: 57.15,59.05 60.96,59.05
  Top 0.813: U$44.P$2 56.52,59.69 57.15,59.05 | 60.96,59.05 61.59,58.42 U$45.P$4
N$46
  Top 0.61: 67.31,59.05 71.12,59.05
  Top 0.813: U$45.P$2 66.67,59.69 67.31,59.05 | 71.12,59.05 71.75,58.42 U$46.P$4
N$47
  Top 0.61: 77.47,59.05 81.28,59.05
  Top 0.813: U$46.P$2 76.83,59.69 77.47,59.05 | 81.28,59.05 81.92,58.42 U$47.P$4
N$48
  Top 0.813: U$47.P$2 87,67.63 85.72,68.9 U$48.P$4
N$49
  Top 0.61: 71.12,67.31 74.93,67.31
  Top 0.813: U$49.P$4 70.48,67.94 71.12,67.31 | 74.93,67.31 75.56,66.67 U$48.P$2
N$50
  Top 0.61: 60.96,67.31 64.77,67.31
  Top 0.813: U$50.P$4 60.33,67.94 60.96,67.31 | 64.77,67.31 65.41,66.67 U$49.P$2
N$51
  Top 0.61: 50.8,67.31 54.61,67.31
  Top 0.813: U$51.P$4 49.21,68.9 50.8,67.31 | 54.61,67.31 55.24,66.67 U$50.P$2
N$52
  Bottom 0.61: U1.3 44.13,62.55 43.18,63.5 43.18,70.48 44.01,71.31 Q1.2
  Bottom 0.813: C63.2 Q1.2
N$53
  Top 0.61: 33.02,67.31 36.83,67.31
  Top 0.813: U$52.P$4 32.38,67.94 33.02,67.31 | 36.83,67.31 37.47,66.67 U$51.P$2
N$54
  Top 0.61: 22.86,67.31 26.67,67.31
  Top 0.813: U$53.P$4 22.23,67.94 22.86,67.31 | 26.67,67.31 27.3,66.67 U$52.P$2
N$55
  Top 0.813: U$54.P$4 22.86,74.61 16.83,74.61 15.24,73.03 15.24,66.36 15.88,65.72 U$53.P$2
N$56
  Top 0.61: 29.21,75.56 33.02,75.56
  Top 0.813: U$54.P$2 28.57,76.2 29.21,75.56 | 33.02,75.56 33.66,74.93 U$55.P$4
N$57
  Top 0.61: U$55.P$2 43.5,77.15
  Top 0.813: 43.5,77.15 44.77,75.88 51.75,75.88 53.66,73.98 U$56.P$4
N$58
  Top 0.61: 64.77,75.56 68.58,75.56
  Top 0.813: U$56.P$2 64.14,76.2 64.77,75.56 | 68.58,75.56 69.22,74.93 U$57.P$4
N$59
  Bottom 0.61: U1.2 47.94,61.28 48.58,61.91 48.58,65.53 Q1.1
  Bottom 0.813: C64.1 Q1.1
N$60
  Bottom 0.61: PAD1.1 47.62,50.8 46.2,52.23 U1.1
N$62
  Top 0.61: 75.25,75.88 78.74,75.88 PAD5.1
  Top 0.813: U$57.P$2 74.3,76.83 75.25,75.88
N$64
  Bottom 0.61: PAD7.1 57.15,60.64 56.83,60.96 56.52,61.28 U1.7
N$65
  Bottom 0.61: PAD8.1 59.69,61.28 58.42,62.55 U1.6
N$66
  Bottom 0.61: PAD9.1 62.23,62.23 60.96,63.5 60.64,63.82 U1.5